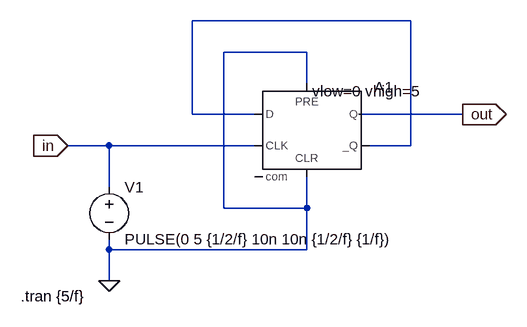
[diagram p0: schematic d-flip-flop.asc]
d-flip-flop.asc, the LTspice schematic file:
Version 4.1
SHEET 1 880 680
WIRE 384 16 48 16
WIRE 224 64 96 64
WIRE 224 112 224 64
WIRE 48 160 48 16
WIRE 144 160 48 160
WIRE 464 160 304 160
WIRE -80 208 -144 208
WIRE 144 208 -80 208
WIRE 384 208 384 16
WIRE 384 208 320 208
WIRE -80 272 -80 208
WIRE 96 304 96 64
WIRE 224 304 224 256
WIRE 224 304 96 304
WIRE -80 368 -80 352
WIRE 224 368 224 304
WIRE 224 368 -80 368
WIRE -80 416 -80 368
FLAG -80 416 0
FLAG -144 208 in
IOPIN -144 208 In
FLAG 464 160 out
IOPIN 464 160 Out
SYMBOL Digital\\dflop 224 112 R0
WINDOW 3 8 12 Left 2
SYMATTR InstName A1
SYMATTR Value vlow=0 vhigh=5
SYMBOL voltage -80 256 R0
WINDOW 123 0 0 Left 0
WINDOW 39 0 0 Left 0
SYMATTR InstName V1
SYMATTR Value PULSE(0 5 {1/2/f} 10n 10n {1/2/f} {1/f})
TEXT -216 440 Left 2 !.tran {5/f}

The netlist it stands for:
* d-flip-flop.asc
A1 N001 0 in 0 0 N001 out 0 DFLOP vlow=0 vhigh=5
V1 in 0 PULSE(0 5 {1/2/f} 10n 10n {1/2/f} {1/f})
.tran {5/f}
.backanno
.end